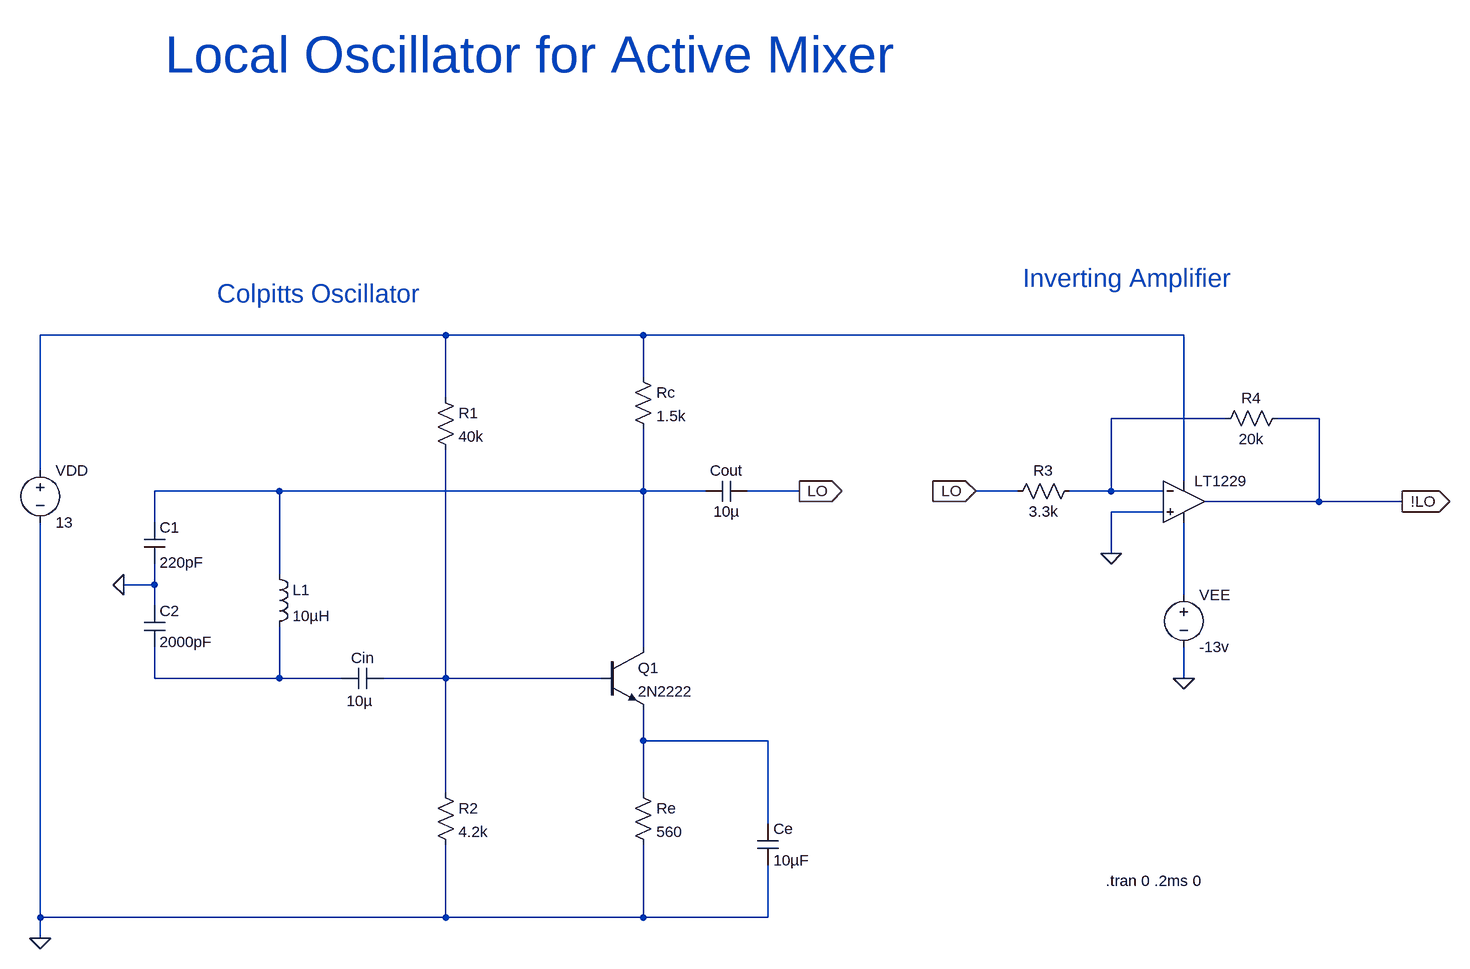
[diagram p0: schematic Local Oscillator.asc]
Local Oscillator.asc, the LTspice schematic file:
Version 4
SHEET 1 2816 680
WIRE 752 -1120 128 -1120
WIRE 1056 -1120 752 -1120
WIRE 1888 -1120 1056 -1120
WIRE 1056 -1056 1056 -1120
WIRE 752 -1024 752 -1120
WIRE 1952 -992 1776 -992
WIRE 2096 -992 2032 -992
WIRE 128 -912 128 -1120
WIRE 1888 -896 1888 -1120
WIRE 496 -880 304 -880
WIRE 1056 -880 1056 -976
WIRE 1056 -880 496 -880
WIRE 1152 -880 1056 -880
WIRE 1296 -880 1216 -880
WIRE 1632 -880 1568 -880
WIRE 1776 -880 1776 -992
WIRE 1776 -880 1712 -880
WIRE 1856 -880 1776 -880
WIRE 2096 -864 2096 -992
WIRE 2096 -864 1920 -864
WIRE 2224 -864 2096 -864
WIRE 1856 -848 1776 -848
WIRE 304 -832 304 -880
WIRE 1776 -784 1776 -848
WIRE 496 -752 496 -880
WIRE 304 -736 304 -768
WIRE 304 -736 256 -736
WIRE 1888 -720 1888 -832
WIRE 304 -704 304 -736
WIRE 1056 -640 1056 -880
WIRE 304 -592 304 -640
WIRE 496 -592 496 -672
WIRE 496 -592 304 -592
WIRE 592 -592 496 -592
WIRE 752 -592 752 -944
WIRE 752 -592 656 -592
WIRE 992 -592 752 -592
WIRE 1888 -592 1888 -640
WIRE 1056 -496 1056 -544
WIRE 1248 -496 1056 -496
WIRE 752 -416 752 -592
WIRE 1056 -416 1056 -496
WIRE 1248 -368 1248 -496
WIRE 128 -224 128 -832
WIRE 752 -224 752 -336
WIRE 752 -224 128 -224
WIRE 1056 -224 1056 -336
WIRE 1056 -224 752 -224
WIRE 1248 -224 1248 -304
WIRE 1248 -224 1056 -224
WIRE 128 -192 128 -224
FLAG 128 -192 0
FLAG 256 -736 0
FLAG 1776 -784 0
FLAG 2224 -864 !LO
IOPIN 2224 -864 Out
FLAG 1888 -592 0
FLAG 1568 -880 LO
IOPIN 1568 -880 In
FLAG 1296 -880 LO
IOPIN 1296 -880 Out
SYMBOL npn 992 -640 R0
SYMATTR InstName Q1
SYMATTR Value 2N2222
SYMBOL voltage 128 -928 R0
WINDOW 123 0 0 Left 0
WINDOW 39 0 0 Left 0
SYMATTR InstName VDD
SYMATTR Value 13
SYMBOL res 1040 -432 R0
SYMATTR InstName Re
SYMATTR Value 560
SYMBOL res 1040 -1072 R0
SYMATTR InstName Rc
SYMATTR Value 1.5k
SYMBOL res 736 -432 R0
SYMATTR InstName R2
SYMATTR Value 4.2k
SYMBOL res 736 -1040 R0
SYMATTR InstName R1
SYMATTR Value 40k
SYMBOL cap 1216 -896 R90
WINDOW 0 0 32 VBottom 2
WINDOW 3 32 32 VTop 2
SYMATTR InstName Cout
SYMATTR Value 10µ
SYMBOL cap 1232 -368 R0
SYMATTR InstName Ce
SYMATTR Value 10µF
SYMBOL cap 656 -608 R90
WINDOW 0 0 32 VBottom 2
WINDOW 3 35 36 VTop 2
SYMATTR InstName Cin
SYMATTR Value 10µ
SYMBOL cap 288 -832 R0
WINDOW 3 24 62 Left 2
SYMATTR Value 220pF
SYMATTR InstName C1
SYMBOL cap 288 -704 R0
SYMATTR InstName C2
SYMATTR Value 2000pF
SYMBOL ind 480 -768 R0
SYMATTR InstName L1
SYMATTR Value 10µH
SYMBOL res 1728 -896 R90
WINDOW 0 0 56 VBottom 2
WINDOW 3 32 56 VTop 2
SYMATTR InstName R3
SYMATTR Value 3.3k
SYMBOL res 2048 -1008 R90
WINDOW 0 0 56 VBottom 2
WINDOW 3 32 56 VTop 2
SYMATTR InstName R4
SYMATTR Value 20k
SYMBOL OpAmps\\UniversalOpamp2 1888 -864 R0
SYMATTR InstName LT1229
SYMBOL voltage 1888 -736 R0
WINDOW 123 0 0 Left 0
WINDOW 39 0 0 Left 0
SYMATTR InstName VEE
SYMATTR Value -13v
TEXT 1768 -280 Left 2 !.tran 0 .2ms 0
TEXT 400 -1184 Left 4 ;Colpitts Oscillator
TEXT 1640 -1208 Left 4 ;Inverting Amplifier
TEXT 320 -1552 Left 6 ;Local Oscillator for Active Mixer

The netlist it stands for:
* Local Oscillator.asc
Q1 N003 N006 N007 0 2N2222
VDD N001 0 13
Re N007 0 560
Rc N001 N003 1.5k
R2 N006 0 4.2k
R1 N001 N006 40k
Cout LO N003 10µ
Ce N007 0 10µF
Cin N006 N005 10µ
C1 N003 0 220pF
C2 0 N005 2000pF
L1 N003 N005 10µH
R3 N002 LO 3.3k
R4 !LO N002 20k
XLT1229 0 N002 N001 N004 !LO level.2 Avol=1Meg GBW=10Meg Slew=10Meg ilimit=25m rail=0 Vos=0 phimargin=45 en=0 enk=0 in=0 ink=0 Rin=500Meg  ; pins IN+ IN- V+ V- OUT
VEE N004 0 -13v
.model NPN NPN
.model PNP PNP
.lib standard.bjt
.tran 0 .2ms 0
* Colpitts Oscillator
* Inverting Amplifier
* Local Oscillator for Active Mixer
.lib UniversalOpamps2.sub
.backanno
.end